# EAGLE schematic ftpiled (EAGLE 7.7.0)
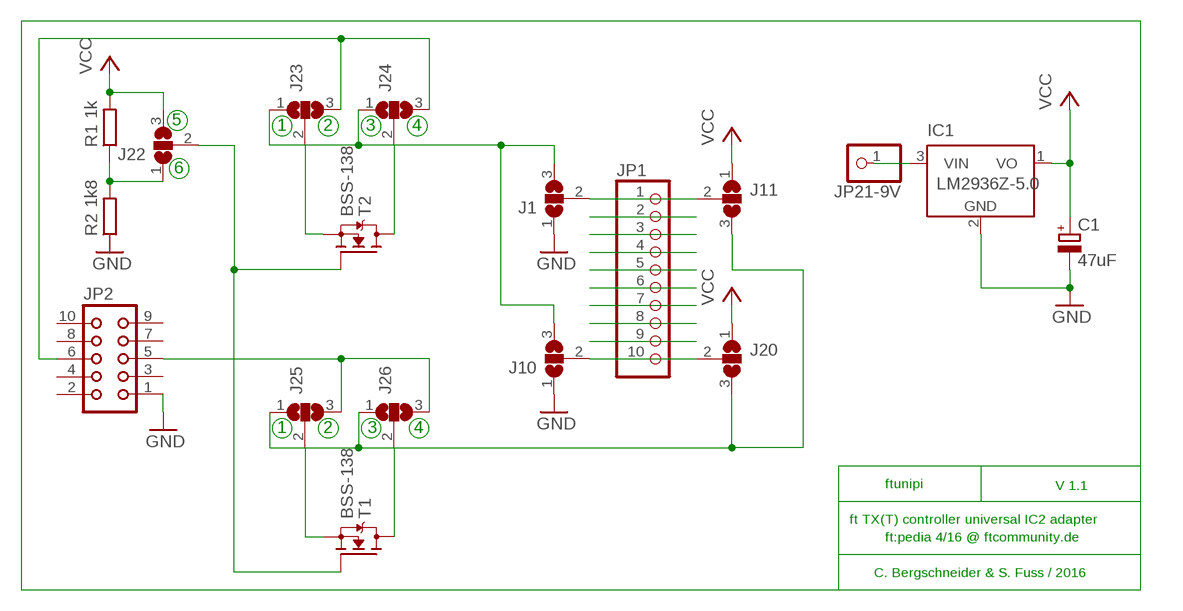
[diagram p0: schematic, sheet 1]

## Parts
C1  47uF  CPOL-EUE2.5-6  [E2,5-6]
IC1  LM2936Z-5.0  [TO92]
J1  SJ2W  [SJ_2]
J10  SJ2W  [SJ_2]
J11  SJ2W  [SJ_2]
J20  SJ2W  [SJ_2]
J22  SJ2W  [SJ_2]
J23  SJ2W  [SJ_2]
J24  SJ2W  [SJ_2]
J25  SJ2W  [SJ_2]
J26  SJ2W  [SJ_2]
JP1  PINHD-1X10  [1X10]
JP2  CON10  [CON10]
JP21-9V  PINHD-1X1  [1X01]
R1  1k  R-EU_R0805  [R0805]
R2  1k8  R-EU_R0805  [R0805]
T1  BSS-138  MOSFET-N-SOT23  [SOT23]
T2  BSS-138  MOSFET-N-SOT23  [SOT23]

## Nets
GND: C1.- IC1.2(GND) J1.1 J10.1 JP2.1 R2.1
J27: J1.2 J11.2
N$1: J23.2 T2.2(S)
N$2: J24.2 T2.3(D)
N$4: J10.2 J20.2
N$5: J1.3 J10.3 J23.1 J24.1
N$15: J26.2 T1.3(D)
N$16: J25.2 T1.2(S)
N$18: J25.3 J26.3 JP2.5
N$19: IC1.3(VIN) JP21-9V.1
N$20: J23.3 J24.3 JP2.6
N$21: J22.1 R1.1 R2.2
N$22: J11.3 J20.3 J25.1 J26.1
N$23: J22.2 T1.1(G) T2.1(G)
VCC: C1.+ IC1.1(VO) J11.1 J20.1 J22.3 R1.2
Unconnected: JP1.1 JP1.2 JP1.3 JP1.4 JP1.5 JP1.6 JP1.7 JP1.8 JP1.9 JP1.10 JP2.2 JP2.3 JP2.4 JP2.7 JP2.8 JP2.9 JP2.10

## Notes on the sheet
- 5
- 1 | 2 | 3 | 4
- 6
- 1 | 2 | 3 | 4
- ftunipi | V 1.1
- ft TX(T) controller universal IC2 adapter
- ft:pedia 4/16 @ ftcommunity.de
- C. Bergschneider & S. Fuss / 2016

## Library data of the parts
C1 = resistor:CPOL-EU: POLARIZED CAPACITOR, European symbol
IC1 = national-semiconductor:LM2936?*: Ultra-Low Quiescent Current LDO Voltage Regulator Source: Data sheet <http://www.national.com/ds/LM/LM2936.pdf>; MF: NATIONAL SEMICONDUCTOR; MPN: LM2936Z-5.0/NOPB; OC_FARNELL: 1150143; OC_NEWARK: 41K4533
J1 J10 J11 J20 J22-J26 = jumper:SJ2W: SMD solder JUMPER
JP1 = pinhead:PINHD-1X10: PIN HEADER
JP2 = con-harting:CON10: CONNECTOR; OC_FARNELL: unknown; OC_NEWARK: unknown
JP21-9V = pinhead:PINHD-1X1: PIN HEADER
R1 R2 = resistor:R-EU_: RESISTOR, European symbol
T1 T2 = we-transistor:MOSFET-N: N-Channel MOSFET (e.g. IRLML2502, BSS138)